# Altium schematic sheet microcontroller.SchDoc
size A4
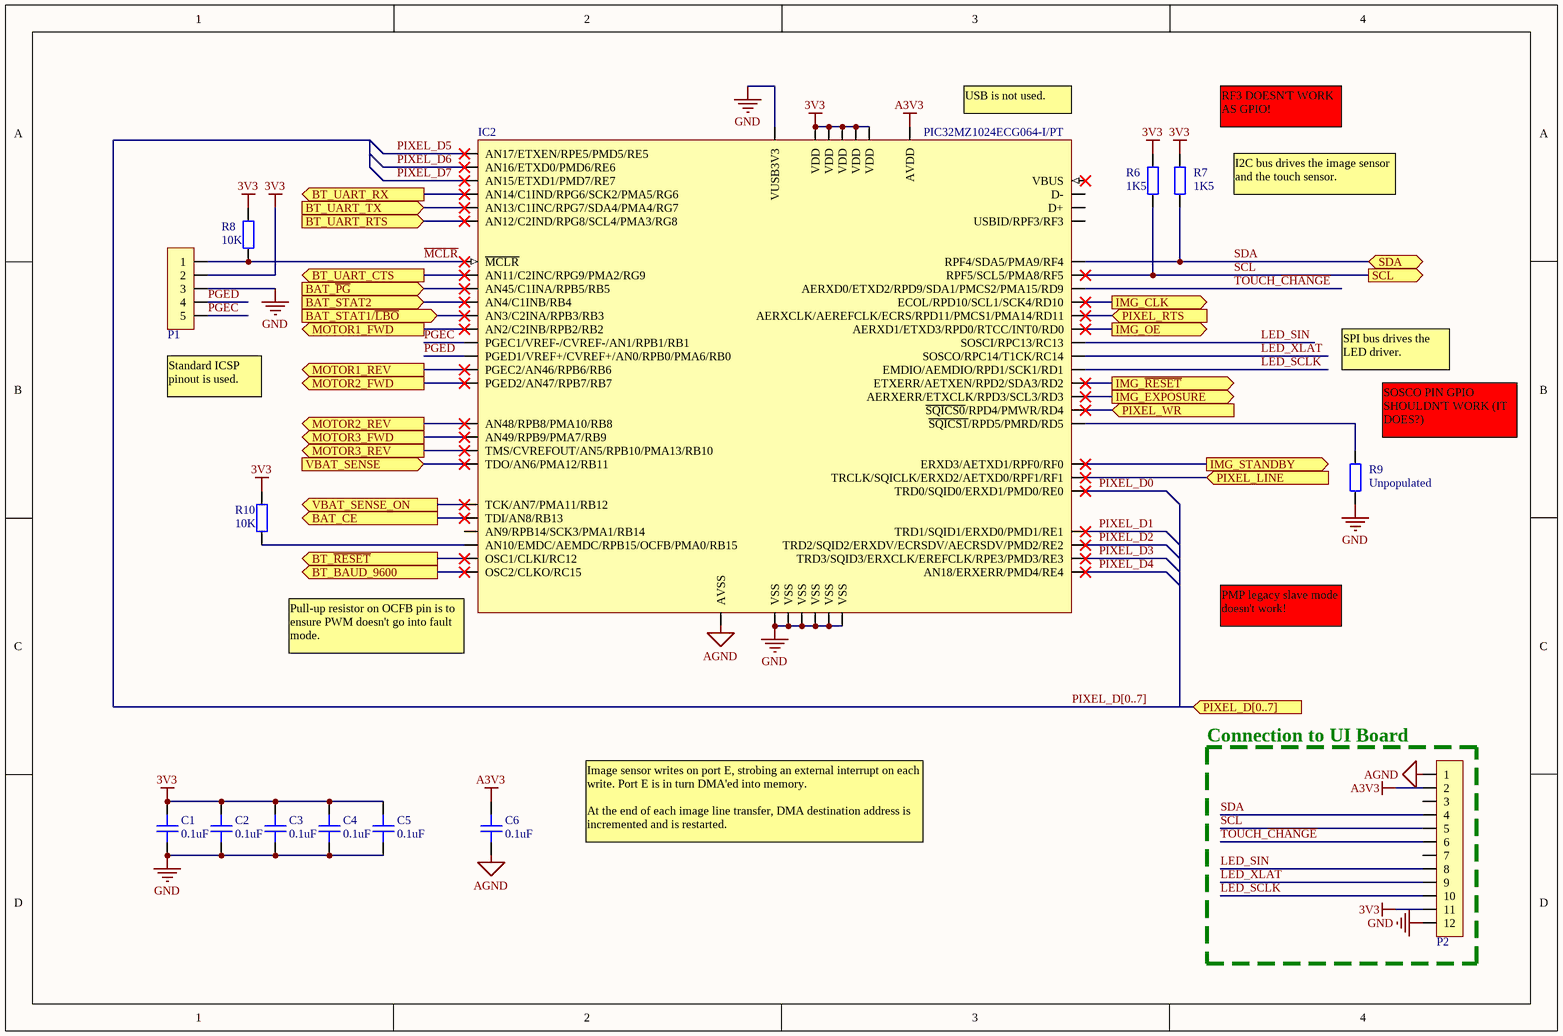
[diagram p0: microcontroller.SchDoc]

## Parts
C1  0.1uF  [1608[0603]_M]
C2  0.1uF  [1608[0603]_M]
C3  0.1uF  [1608[0603]_M]
C4  0.1uF  [1608[0603]_M]
C5  0.1uF  [1608[0603]_M]
C6  0.1uF  [1608[0603]_M]
IC2  PIC32MZ1024ECG064-I/PT  [TQFP-64_M]
P1  Connector 5  [BM05B-SRSS_N]  (value not drawn)
P2  Connector 12  [FH33-12S-0.5SH_N]  (value not drawn)
R6  1K5  [1608[0603]_M]
R7  1K5  [1608[0603]_M]
R8  10K  [1608[0603]_M]
R9  Unpopulated  [1608[0603]_M]
R10  10K  [1608[0603]_M]

## Blocks framed on the sheet
Connection to UI Board: P2

## Ports
BAT_CE (out), BAT_STAT1/~{LBO} (in), BAT_STAT2 (in), BAT_~{PG} (in), BT_BAUD_9600 (out), BT_UART_CTS (out), BT_UART_RTS (in), BT_UART_RX (out), BT_UART_TX (in), BT_~{RESET} (out), IMG_CLK (out), IMG_EXPOSURE (out), IMG_OE (out), IMG_STANDBY (out), IMG_~{RESET} (out), MOTOR1_FWD (out), MOTOR1_REV (out), MOTOR2_FWD (out), MOTOR2_REV (out), MOTOR3_FWD (out), MOTOR3_REV (out), PIXEL_D[0..7] (in), PIXEL_LINE (in), PIXEL_RTS (in), PIXEL_WR (in), SCL (out), SDA (bidir), VBAT_SENSE (in), VBAT_SENSE_ON (out)

## Nets
3V3: C1.2 C2.2 C3.2 C4.2 C5.2 IC2.8(VDD) IC2.26(VDD) IC2.39(VDD) IC2.54(VDD) IC2.60(VDD) P1.2 P2.11 R6.2 R7.2 R8.2 R10.2
A3V3: C6.2 IC2.19(AVDD) P2.2
AGND: C6.1 IC2.20(AVSS) P2.1
GND: C1.1 C2.1 C3.1 C4.1 C5.1 IC2.7(VSS) IC2.25(VSS) IC2.34(VUSB3V3) IC2.35(VSS) IC2.40(VSS) IC2.55(VSS) IC2.59(VSS) P1.3 P2.12 R9.1
BAT_CE: IC2.28(TDI/AN8/RB13) ; port BAT_CE
BAT_~{PG}: IC2.11(AN45/C1INA/RPB5/RB5) ; port BAT_~{PG}
BAT_STAT1/~{LBO}: IC2.13(AN3/C2INA/RPB3/RB3) ; port BAT_STAT1/~{LBO}
BAT_STAT2: IC2.12(AN4/C1INB/RB4) ; port BAT_STAT2
BT_BAUD_9600: IC2.32(OSC2/CLKO/RC15) ; port BT_BAUD_9600
BT_~{RESET}: IC2.31(OSC1/CLKI/RC12) ; port BT_~{RESET}
BT_UART_CTS: IC2.10(AN11/C2INC/RPG9/PMA2/RG9) ; port BT_UART_CTS
BT_UART_RTS: IC2.6(AN12/C2IND/RPG8/SCL4/PMA3/RG8) ; port BT_UART_RTS
BT_UART_RX: IC2.4(AN14/C1IND/RPG6/SCK2/PMA5/RG6) ; port BT_UART_RX
BT_UART_TX: IC2.5(AN13/C1INC/RPG7/SDA4/PMA4/RG7) ; port BT_UART_TX
IMG_CLK: IC2.44(ECOL/RPD10/SCL1/SCK4/RD10) ; port IMG_CLK
IMG_EXPOSURE: IC2.51(AERXERR/ETXCLK/RPD3/SCL3/RD3) ; port IMG_EXPOSURE
IMG_OE: IC2.46(AERXD1/ETXD3/RPD0/RTCC/INT0/RD0) ; port IMG_OE
IMG_~{RESET}: IC2.50(ETXERR/AETXEN/RPD2/SDA3/RD2) ; port IMG_~{RESET}
IMG_STANDBY: IC2.56(ERXD3/AETXD1/RPF0/RF0) ; port IMG_STANDBY
LED_SCLK: IC2.49(EMDIO/AEMDIO/RPD1/SCK1/RD1) P2.10
LED_SIN: IC2.47(SOSCI/RPC13/RC13) P2.8
LED_XLAT: IC2.48(SOSCO/RPC14/T1CK/RC14) P2.9
~{MCLR}: IC2.9(~{MCLR}) P1.1 R8.1
MOTOR1_FWD: IC2.14(AN2/C2INB/RPB2/RB2) ; port MOTOR1_FWD
MOTOR1_REV: IC2.17(PGEC2/AN46/RPB6/RB6) ; port MOTOR1_REV
MOTOR2_FWD: IC2.18(PGED2/AN47/RPB7/RB7) ; port MOTOR2_FWD
MOTOR2_REV: IC2.21(AN48/RPB8/PMA10/RB8) ; port MOTOR2_REV
MOTOR3_FWD: IC2.22(AN49/RPB9/PMA7/RB9) ; port MOTOR3_FWD
MOTOR3_REV: IC2.23(TMS/CVREFOUT/AN5/RPB10/PMA13/RB10) ; port MOTOR3_REV
PGEC: IC2.15(PGEC1/VREF-/CVREF-/AN1/RPB1/RB1) P1.5
PGED: IC2.16(PGED1/VREF+/CVREF+/AN0/RPB0/PMA6/RB0) P1.4
PIXEL_D0: IC2.58(TRD0/SQID0/ERXD1/PMD0/RE0)
PIXEL_D1: IC2.61(TRD1/SQID1/ERXD0/PMD1/RE1)
PIXEL_D2: IC2.62(TRD2/SQID2/ERXDV/ECRSDV/AECRSDV/PMD2/RE2)
PIXEL_D3: IC2.63(TRD3/SQID3/ERXCLK/EREFCLK/RPE3/PMD3/RE3)
PIXEL_D4: IC2.64(AN18/ERXERR/PMD4/RE4)
PIXEL_D5: IC2.1(AN17/ETXEN/RPE5/PMD5/RE5)
PIXEL_D6: IC2.2(AN16/ETXD0/PMD6/RE6)
PIXEL_D7: IC2.3(AN15/ETXD1/PMD7/RE7)
PIXEL_LINE: IC2.57(TRCLK/SQICLK/ERXD2/AETXD0/RPF1/RF1) ; port PIXEL_LINE
PIXEL_RTS: IC2.45(AERXCLK/AEREFCLK/ECRS/RPD11/PMCS1/PMA14/RD11) ; port PIXEL_RTS
PIXEL_WR: IC2.52(~{SQICS0}/RPD4/PMWR/RD4) ; port PIXEL_WR
SCL: IC2.42(RPF5/SCL5/PMA8/RF5) P2.5 R6.1 ; port SCL
SDA: IC2.41(RPF4/SDA5/PMA9/RF4) P2.4 R7.1 ; port SDA
TOUCH_~{CHANGE}: IC2.43(AERXD0/ETXD2/RPD9/SDA1/PMCS2/PMA15/RD9) P2.6
VBAT_SENSE: IC2.24(TDO/AN6/PMA12/RB11) ; port VBAT_SENSE
VBAT_SENSE_ON: IC2.27(TCK/AN7/PMA11/RB12) ; port VBAT_SENSE_ON
NetIC2_30: IC2.30(AN10/EMDC/AEMDC/RPB15/OCFB/PMA0/RB15) R10.1
NetIC2_53: IC2.53(~{SQICS1}/RPD5/PMRD/RD5) R9.2

Not connected (* = marked no-connect by the designer): IC2 29(AN9/RPB14/SCK3/PMA1/RB14) 33(VBUS)* 36(D-) 37(D+) 38(USBID/RPF3/RF3); P2 3 7

## Buses and harness runs
bus PIXEL_D[0..7] = port PIXEL_D[0..7]

## Notes on the sheet
- (near IC2) USB is not used.
- RF3 DOESN'T WORK AS GPIO!
- I2C bus drives the image sensor and the touch sensor.
- SPI bus drives the LED driver.
- (near P1) Standard ICSP pinout is used.
- (near R9) SOSCO PIN GPIO SHOULDN'T WORK (IT DOES?)
- (near IC2) Pull-up resistor on OCFB pin is to ensure PWM doesn't go into fault mode.
- PMP legacy slave mode doesn't work!
- Image sensor writes on port E, strobing an external interrupt on each write. Port E is in turn DMA'ed into memory.
  At the end of each image line transfer, DMA destination address is incremented and is restarted.

## Library data of the parts
C1-C6 = Capacitor: Generic Capacitor; Value: 0.1uF
IC2 = PIC32MZ1024ECG064: 32-bit Microcontroller
P1 = Connector 5: Connector 5-Pin
P2 = Connector 12: Connector 12-Pin
R6-R10 = Resistor: Generic Resistor
  R6 R7: Value: 1K5
  R8 R10: Value: 10K
  R9: Value: Unpopulated